# Altium schematic sheet Level-Translator.schdoc: TITRE
size Letter; ApprovedBy: APPROUVÉ PAR; Organization: Cegep Limoilou; Address1: 1300, 8e Avenue; Address2: Québec, QC; Address3: Canada; Address4: G1J 5L5; SheetNumber: 4; SheetTotal: 4
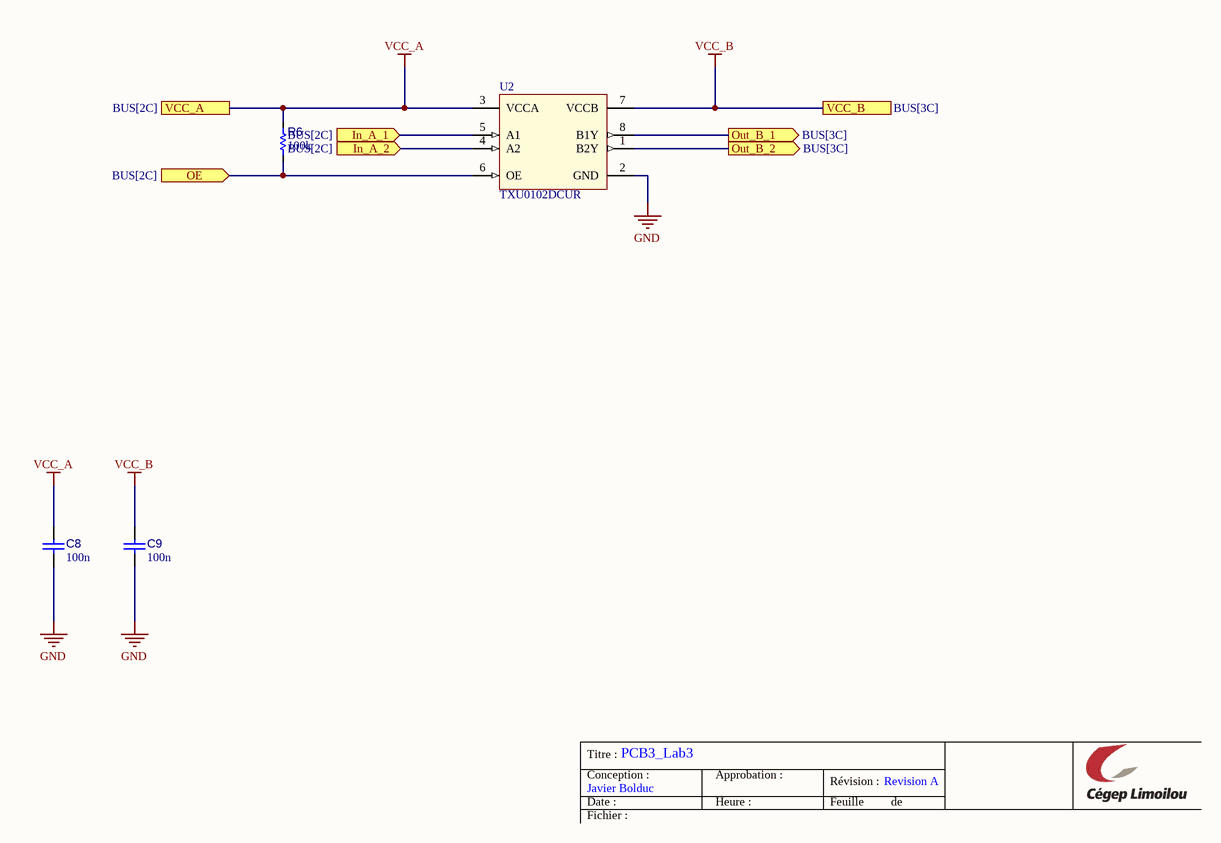
[diagram p0: Level-Translator.schdoc]

## Parts
C8  value 100n  [C_1608[0603]]  (hidden comment: CAP CER 100nF 50V 0603)
C9  value 100n  [C_1608[0603]]  (hidden comment: CAP CER 100nF 50V 0603)
R6  value 100k  [R_1608[0603]]  (hidden comment: Res 100k 1% 0603)
U2  TXU0102DCUR  [U_VSSOP50P310X200X90-8N]

## Ports
In_A_1 (in, see BUS[2C]), In_A_2 (in, see BUS[2C]), OE (in, see BUS[2C]), Out_B_1 (out, see BUS[3C]), Out_B_2 (out, see BUS[3C]), VCC_A (see BUS[2C]), VCC_B (see BUS[3C])

## Nets
GND: C8.2 C9.2 U2.2(GND)
VCC_A: C8.1 R6.1 U2.3(VCCA) ; port VCC_A
VCC_B: C9.1 U2.7(VCCB) ; port VCC_B
In_A_1: U2.5(A1) ; port In_A_1
In_A_2: U2.4(A2) ; port In_A_2
OE: R6.2 U2.6(OE) ; port OE
Out_B_1: U2.8(B1Y) ; port Out_B_1
Out_B_2: U2.1(B2Y) ; port Out_B_2

## Notes on the sheet
- Titre :
- Conception :
- Date :
- Javier Bolduc
- PCB3_Lab3
- Approbation :
- Heure :
- Révision :
- Feuille
- Revision A
- de
- Fichier :

## Library data of the parts
C8 C9 = CAP002: Capacitor type 1; Manufacturer 1: Yageo; Manufacturer Part Number 1: CC0603KRX7R9BB104; LibRef: CAP002; Code CEGEP: COND0143SM; Tolerance: 10%; Dielectric: X7R; Rated Voltage: 50V; Mounting Technology: SMT; Supplier 1: LCSC; Supplier Part Number 1: C14663
R6 = RES002: Resistor type 1; Manufacturer 1: Yageo; Manufacturer Part Number 1: RC0603FR-07100KL; LibRef: RES002; Puissance: 1/10W; Max Working Voltage: 75V; Tolerance: 1%; Mounting Technology: SMT; Supplier 1: LCSC; Supplier Part Number 1: C14675
U2 = U_TXU0102DCU: Two channel fixed-direction level shifter 8-VSSOP; Manufacturer 1: TI; Manufacturer Part Number 1: TXU0102DCUR; Mounting Technology: SMT; Supplier 1: LCSC; Supplier 2: Digikey; Supplier Part Number 1: C5217871; Supplier Part Number 2: 296-TXU0102DCURCT-ND